# Altium schematic sheet Microcontroller.SchDoc
size A4; SheetNumber: 4; SheetTotal: 6
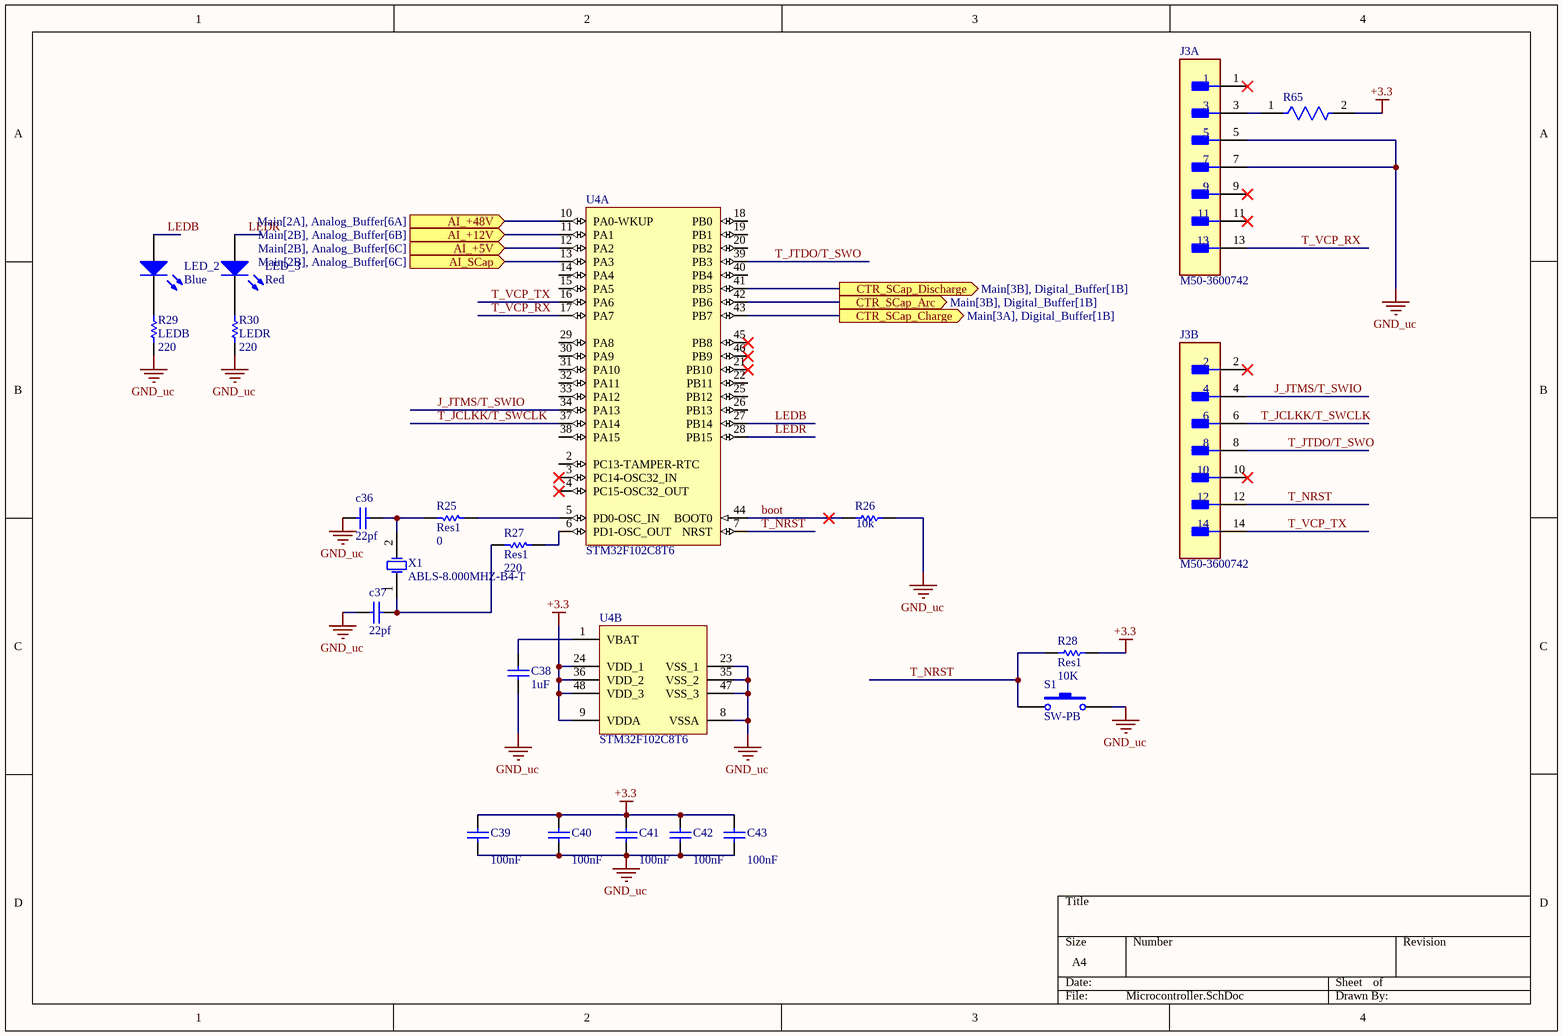
[diagram p0: Microcontroller.SchDoc]

## Parts
c36  22pf  [0805C]
c37  22pf  [0805C]
C38  1uF  [0805C]
C39  value 100nF  [0805C]
C40  value 100nF  [0805C]
C41  value 100nF  [0805C]
C42  value 100nF  [0805C]
C43  value 100nF  [0805C]
J3  M50-3600742  [FP-M50-3600742-MFG]  (parts A,B of 2)
LED_2  Blue  [0805LED]
LED_3  Red  [0805LED]
R25  Res1  value 0  [0805L]
R26  value 10k  [0805L]  (hidden comment: Res1)
R27  Res1  value 220  [0805L]
R28  Res1  value 10K  [0805L]
R29  LEDB  value 220  [0805L]
R30  LEDR  value 220  [0805L]
R65  RC1206JR-070RL  [FP-RC1206-MFG]  (value not drawn)
S1  SW-PB  [sw-pb-4p]
U4  STM32F102C8T6  [STM-LQFP48_N]  (parts A,B of 2)
X1  ABLS-8.000MHZ-B4-T  [ABRA-ABLS-14.7456MHZ-B2-T_V]

## Ports
AI_+5V (in, see Main[2B], Analog_Buffer[6C]), AI_+12V (in, see Main[2B], Analog_Buffer[6B]), AI_+48V (in, see Main[2A], Analog_Buffer[6A]), AI_SCap (in, see Main[2B], Analog_Buffer[6C]), CTR_SCap_Arc (out, see Main[3B], Digital_Buffer[1B]), CTR_SCap_Charge (out, see Main[3A], Digital_Buffer[1B]), CTR_SCap_Discharge (out, see Main[3B], Digital_Buffer[1B])

## Nets
+3.3: C39.2 C40.2 C41.2 C42.2 C43.2 R28.1 R65.2 U4.9(VDDA) U4.24(VDD_1) U4.36(VDD_2) U4.48(VDD_3)
GND_uc: c36.2 c37.2 C38.1 C39.1 C40.1 C41.1 C42.1 C43.1 J3.5 J3.7 R26.2 R29.2 R30.1 S1.2 U4.8(VSSA) U4.23(VSS_1) U4.35(VSS_2) U4.47(VSS_3)
AI_+5V: U4.12(PA2) ; port AI_+5V
AI_+12V: U4.11(PA1) ; port AI_+12V
AI_+48V: U4.10(PA0-WKUP) ; port AI_+48V
AI_SCap: U4.13(PA3) ; port AI_SCap
boot: R26.1 U4.44(BOOT0)
CTR_SCap_Arc: U4.42(PB6) ; port CTR_SCap_Arc
CTR_SCap_Charge: U4.43(PB7) ; port CTR_SCap_Charge
CTR_SCap_Discharge: U4.41(PB5) ; port CTR_SCap_Discharge
J_JTMS/T_SWIO: J3.4 U4.34(PA13)
LEDB: LED_2.1(A) U4.27(PB14)
LEDR: LED_3.1(A) U4.28(PB15)
T_JCLKK/T_SWCLK: J3.6 U4.37(PA14)
T_JTDO/T_SWO: J3.8 U4.39(PB3)
T_NRST: J3.12 R28.2 S1.1 U4.7(NRST)
T_VCP_RX: J3.13 U4.17(PA7)
T_VCP_TX: J3.14 U4.16(PA6)
Netc36_1: c36.1 R25.2 X1.2(X2)
Netc37_1: c37.1 R27.1 X1.1(X1)
NetC38_2: C38.2 U4.1(VBAT)
NetJ3_3: J3.3 R65.1
NetLED_2_2: LED_2.2(K) R29.1
NetLED_3_2: LED_3.2(K) R30.2
NetR25_1: R25.1 U4.5(PD0-OSC_IN)
NetR27_2: R27.2 U4.6(PD1-OSC_OUT)

Not connected (* = marked no-connect by the designer): J3 1* 2* 9* 10* 11*; U4 2(PC13-TAMPER-RTC) 3(PC14-OSC32_IN)* 4(PC15-OSC32_OUT)* 14(PA4) 15(PA5) 18(PB0) 19(PB1) 20(PB2) 21(PB10)* 22(PB11) 25(PB12) 26(PB13) 29(PA8) 30(PA9) 31(PA10) 32(PA11) 33(PA12) 38(PA15) 40(PB4) 45(PB8)* 46(PB9)*

## Library data of the parts
c36 c37 C38 = Cap_UP: Capacitor; Published: 8-Jun-2000; LatestRevisionDate: 17-Jul-2002; LatestRevisionNote: Re-released for DXP Platform.; PackageReference: RAD-0.3; Publisher: Altium Limited
  c36 c37: Value: 22pf
  C38: Value: 1uF
C39-C43 = Cap: Capacitor; Manufacturer: Generic Components; Class: Passive; Published: 08/06/2000; Publisher: Altium Hobart Technology Centre; SubClass: Capacitor
J3 = CMP-15831-000067-1: CONN HEADER SMD 14POS 1.27MM; Row Spacing: 0.05inch; Number of Contacts: 14; Contact Resistance: 30mR; Gender: Male; Max Current Rating: 1A; Radiation Hardening: No; Series: Archer M50; Package Quantity: 500; Length: 8.89mm; Orientation: Straight; Number of Positions: 14; Termination: Solder; Housing Material: Thermoplastic; Depth: 3.41mm; Pitch: 1.27mm; Packaging: Bulk; Contact Plating: Gold; Contact Mating Length: 0.118inch; Max Operating Temperature: 105°C; Number of Rows: 2; Min Operating Temperature: -40°C; Color: Black; Mount: Surface Mount; Contact Material: Copper Alloy
LED_2 LED_3 = LED3: Typical BLUE SiC LED; Published: 8-Jun-2000; LatestRevisionDate: 17-Dec-2003; LatestRevisionNote: PCB Footprint replaced.; DatasheetDocument: 16-Apr-2002; PackageDocument: 16-Apr-2002; PackageReference: 3.5X2.8X1.9; Publisher: Altium Limited
R25-R30 = Res1: Resistor; Published: 8-Jun-2000; LatestRevisionDate: 17-Jul-2002; LatestRevisionNote: Re-released for DXP Platform.; PackageReference: AXIAL-0.3; Publisher: Altium Limited
R65 = CMP-2100-03681-2: RES SMD 0 OHM JUMPER 1/4W 1206; Manufacturer: YAGEO; Voltage Rating: 200V; Temperature Coefficient: 300ppm/°C; Power Rating: 0.25W; Value: 0Ω; Tolerance: 5%; Manufacturer Part Number: RC1206JR-070RL; Temperature Range Low: -55°C; Category: Res; Automotive: No; Ipc Land Pattern Name: RESC310160X55; Device Class L1: Passive Components; Temperature: -55°C to +155°C; ComponentLink2URL: https://www.yageo.com/upload/media/product/productsearch/datasheet/rchip/PYu-RC_Group_51_RoHS_L_10.pdf; Lead Free: Yes; Height: 0.65mm; Footprint Url: https://www.yageo.com/upload/website/yageo_PYu-R_Mount_10_19050818_343.pdf; Package: RC1206; Digikey Description: RES SMD 0 OHM JUMPER 1/4W 1206; Temperature Range High: +155°C; Device Class L3: Chip SMD Resistors; Device Class L2: Resistors; Octopart: https://octopart.com/rc1206jr-070rl-yageo-40025601; Resistance: 0Ω; Series: RC; ComponentLink2Description: Datasheet; Composition: Thick Film; RoHS: TRUE; Mouser Description: Resistor: thick film; SMD; 1206; 0O; 0.25W; ±5%; -55÷155°C
S1 = SW-PB: Switch; Published: 24-Mar-1999; LatestRevisionDate: 17-Jul-2002; LatestRevisionNote: Re-released for DXP Platform.; PackageReference: SPST-2; Publisher: Altium Limited
U4 = STM32F102C8T6: ARM Cortex-M3 32-bit MCU, 64 KB Flash, 10 KB Internal RAM, 37 I/Os, 48-pin LQFP, -40 to 85 degC, Tray; A/D Converter: 1x12-bit (10 Channel); FLASH Size (Prog) (kB): 64; I/Os (High Current): 37; Internal RAM Size (kB): 10; Operating Frequency(F) (Processor speed) (MHz): 48; Supply Voltage(Vcc) min (V): 2; DatasheetVersion: Rev. 5; PackageVersion: Rev. 6, 06/2013; PackageReference: LQFP48; PackageDescription: 48-Pin Low Profile Quad Flat Package, 7 x 7 mm Body, 0.5 mm Pitch; Supplier 1: Digi-Key; Supplier Part Number 1: 497-8307-ND; Supplier 2: Farnell; Supplier Part Number 2: 2333153; Supplier 3: Newark; Supplier Part Number 3: 99W9777; Supplier 4: Mouser; Supplier Part Number 4: 511-STM32F102C8T6; Core: ARM Cortex-M3; Packing: Tray; Mounting Technology: Surface Mount; PartNumber: STM32F102C8T6; ComponentLink1Description: Manufacturer URL; ComponentLink1URL: http://www.st.com/web/en/home.html; ComponentLink2Description: Datasheet; ComponentLink2URL: http://www.st.com/st-web-ui/static/active/en/resource/technical/document/datasheet/CD00210831.pdf; ComponentLink3Description: Package Specification; ComponentLink3URL: http://www.st.com/st-web-ui/static/active/en/resource/technical/document/datasheet/DM00058181.pdf
X1 = CMP-2000-05726-1: Low Profile Crystal, 8.0 MHz, +/- 30 ppm, -20 to 70 degC, 2-Pin SMD, RoHS, Tape and Reel; Brand: ABRACON; Case Length: 11.4mm; Frequency Stability: 50PPM; ESR: 80Ohms; Case Height: 4.2mm; Tolerance: 30PPM; Frequency: 8MHz; Case Width: 4.7mm; Load Capacitance: 18pF; Datasheet Version: 04/2011; Termination Style: SMD/SMT; Dimensions: 4.7mmWx11.4mmLx4.2mmH; Packaging: Reel; Manufacturer: ABRACON; Package URL: http://www.abracon.com/Support/PackageDrawing/Resonators/ABLS-2D.pdf; Mounting Technology: SurfaceMount; Package Reference: ABLS-14.7456MHZ-B2-T; Product Category: Crystals; Package Description: 2-Pin Surface Mount Device, Body 11.4 x 4.7 mm; Package / Case: HC-49/US; Mounting Style: SMD/SMT; Operating Temperature Range: -20Cto+70C; Series: ABLS; Factory Pack Quantity: 1000; Datasheet URL: http://www.abracon.com/Resonators/abls.pdf; Manufacturer URL: http://www.abracon.com/; RoHS: Details; Type: LowProfileMicroprocessorCrystal